# EAGLE design SD Card (EAGLE 5.04)
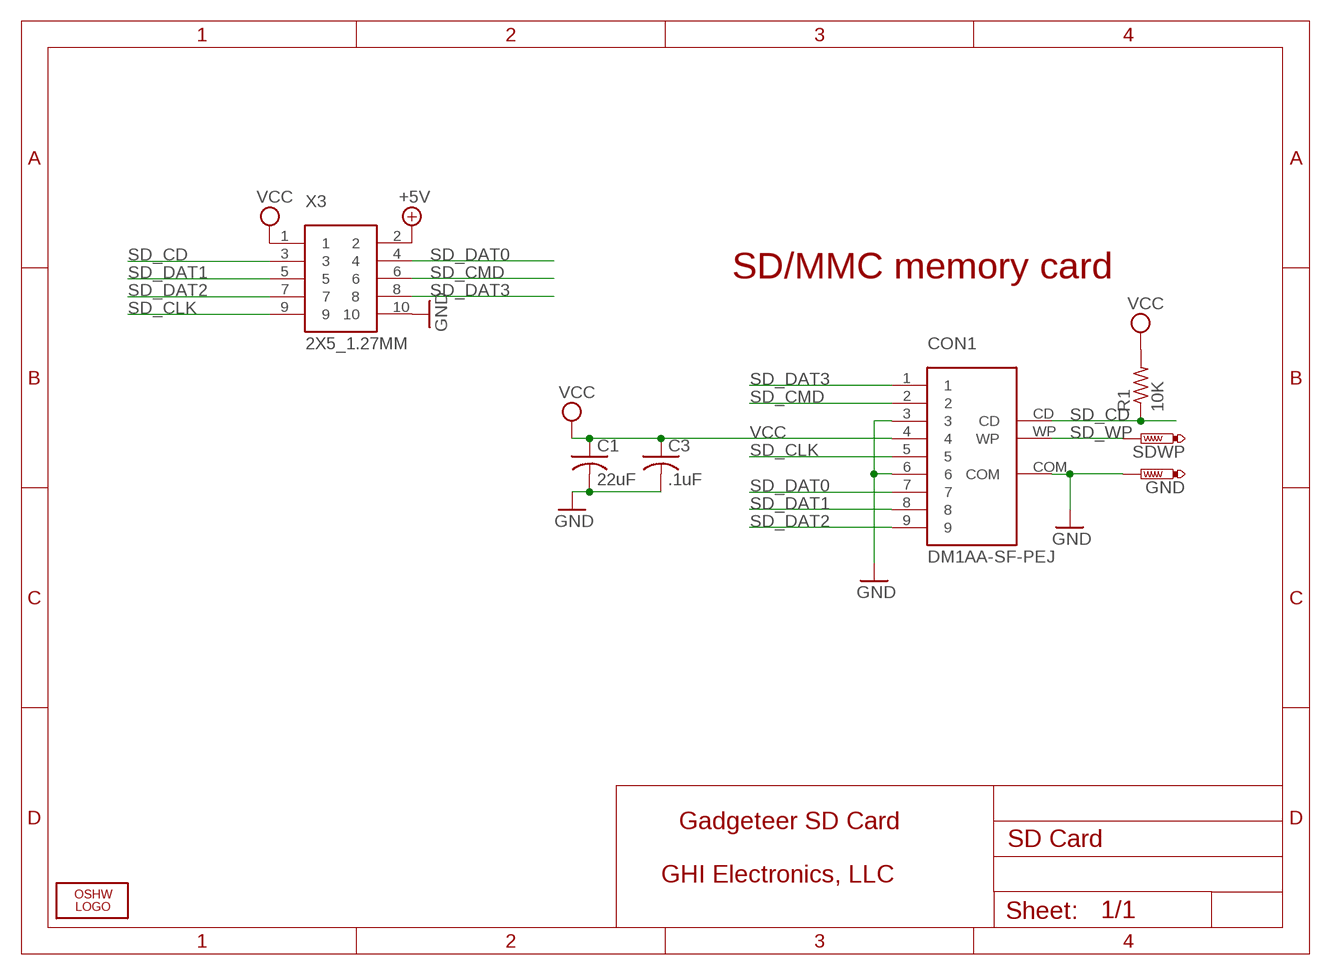
[diagram p0: schematic, sheet 1]

## Parts
C1  22uF  C-USC0805K  [C0805K]
C3  .1uF  C-USC0603K  [C0603K]
CON1  DM1AA-SF-PEJ  [DM1AA-SF-PEJ]
GND  PTR1PAD1-20  [P1-20]
LOGO1  LOGO-OSHW-FILLX0200-NT  [OSHW_FILLX200_NOTEXT]
R1  10K  R-US_R0603  [R0603]
SDWP  PTR1PAD1-20  [P1-20]
X3  2X5_1.27MM  [2X5_1.27MM]

## Nets
+5V [power]: X3.2
GND [power]: C1.2 C3.2 CON1.3 CON1.6 CON1.COM GND.1(TP) X3.10
SD_CD: CON1.CD R1.1 X3.3
SD_CLK: CON1.5 X3.9
SD_CMD: CON1.2 X3.6
SD_DAT0: CON1.7 X3.4
SD_DAT1: CON1.8 X3.5
SD_DAT2: CON1.9 X3.7
SD_DAT3: CON1.1 X3.8
SD_WP: CON1.WP SDWP.1(TP)
VCC [power]: C1.1 C3.1 CON1.4 R1.2 X3.1

## Notes on the sheet
- SD/MMC memory card
- Gadgeteer SD Card
- GHI Electronics, LLC

## Library data of the parts
C1 C3 = rcl:C-US: CAPACITOR, American symbol
CON1 = GHI:DM1AA-SF-PEJ
GND SDWP = testpad:PTR1: TEST PIN
LOGO1 = Logo:LOGO-OSHW-FILL
R1 = rcl:R-US_: RESISTOR, American symbol
X3 = GHI:2X5_1.27MM

## Net classes
0 default: width 0.254 mm, drill 0.381 mm, clearance 0.203 mm

## Board
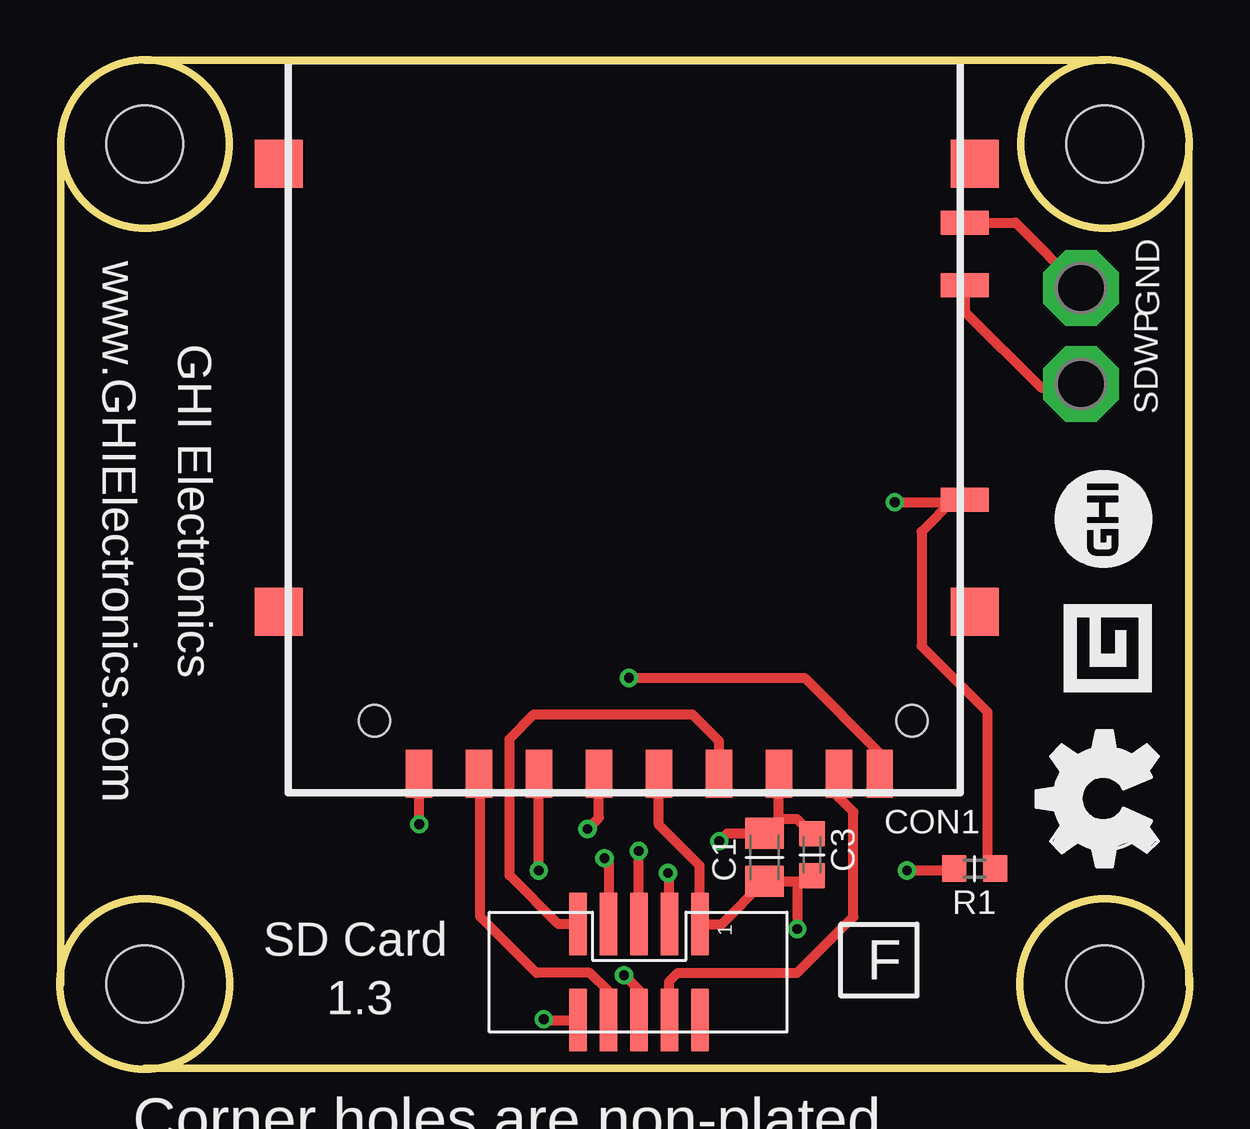
[diagram p1: board, top side]
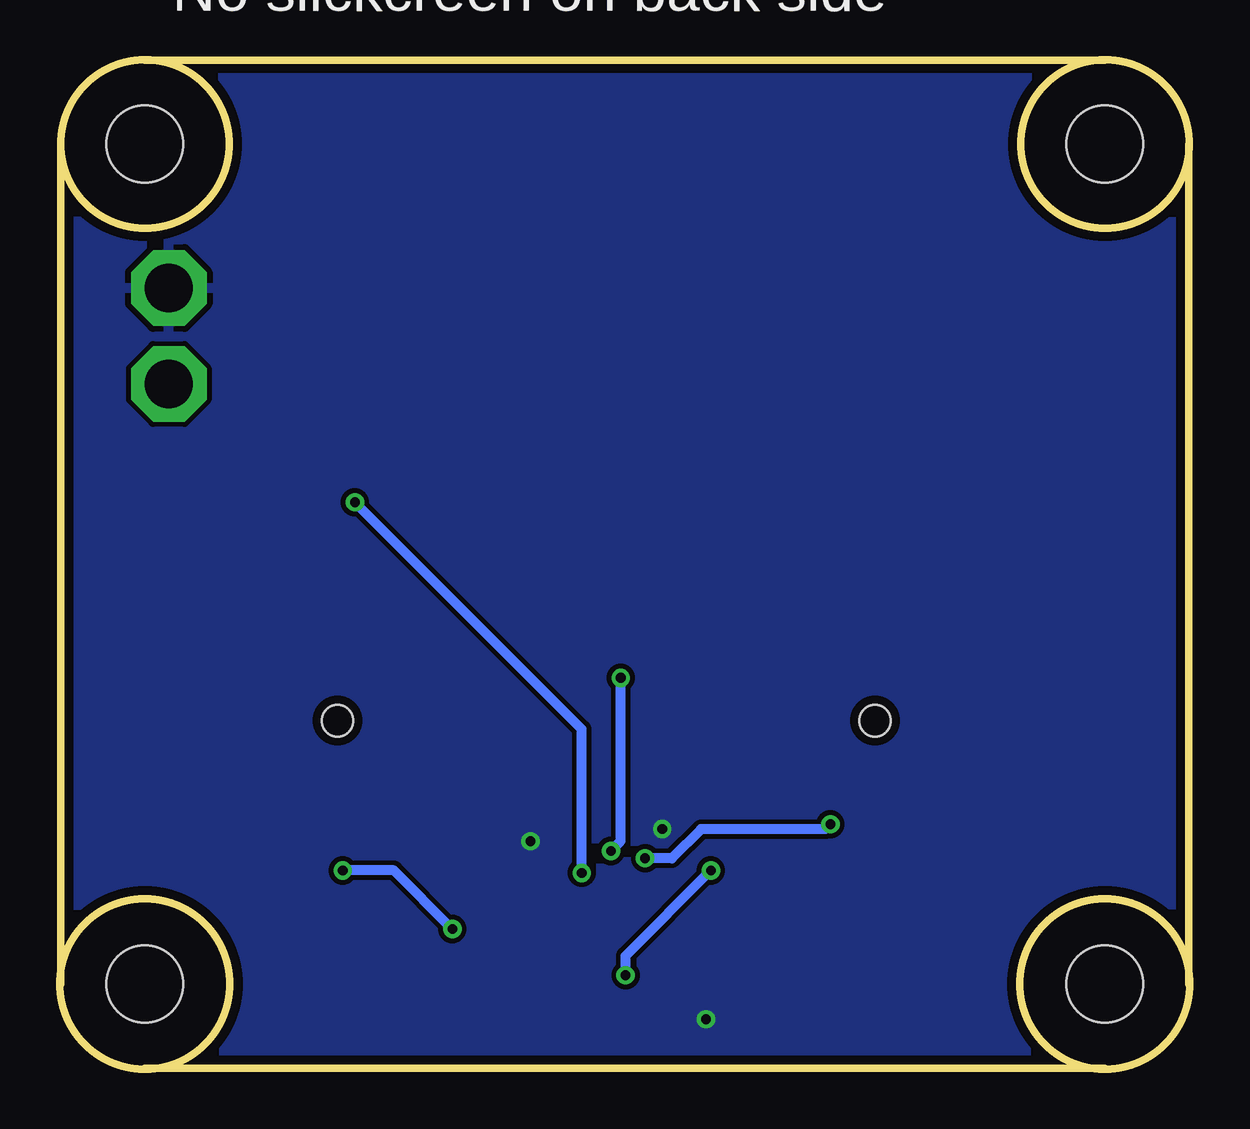
[diagram p2: board, bottom side, seen from below]

Size 47.07 x 42.04 mm. Coordinates in mm from the lower left corner, seen from the top.
Outline: 47.04,3.54 47.04,38.54
Outline: 0.04,38.54 0.04,3.54
Outline: 3.54,42.04 43.54,42.04
Outline: 43.54,0.04 3.54,0.04
Outline: circle at 3.54,38.54 radius 3.5
Outline: circle at 43.54,38.54 radius 3.5
Outline: circle at 43.54,3.54 radius 3.54
Outline: circle at 3.54,3.54 radius 3.54
Copper layers (1+16): Top 0.035mm / dielectric 1.5mm / Bottom 0.035mm
Design rules "default *": minimum track width 8mil, minimum drill 12mil, track to track 8mil, track to pad 8mil, pad to pad 8mil, via to via 8mil, smd to smd 8mil, copper to edge 15mil, drill to drill 8mil, minimum pad ring 10mil, minimum via ring 7mil, stop-mask expansion 4mil, vias tented up to drill 50mil, thermal gap 10mil
Holes 3.2 mm at 3.54,3.54 43.54,38.54 3.54,38.54 43.54,3.54

### Footprints (pad centres in the part's own frame; a part is rotated, then mirrored left to right if it is on the bottom)
C0805K = smd 1.3 x 1.6: 1 -1,0; 2 1,0
C0603K = smd 1.05 x 1.08: 1 -0.875,0; 2 0.875,0
DM1AA-SF-PEJ = smd 1.1 x 2: 1 6.08,15.73; 2 3.58,15.73; 3 1.08,15.73; 4 -1.42,15.73; 5 -3.92,15.73; 6 -6.42,15.73; 7 -8.92,15.73; 8 -10.62,15.73; 9 8.58,15.73 | smd 2 x 1: CD -14.17,4.33; COM -14.17,-7.22; WP -14.17,-4.62 | smd 2 x 2: P$10 -14.57,-9.67; P$11 -14.57,8.98; P$12 14.43,8.98; P$13 14.43,-9.67 | hole 1.3: -11.97,13.53; 10.43,13.53
P1-20 = drill 2.007 pad 3.15 octagon: 1 0,0
R0603 = smd 1 x 1.1: 1 -0.85,0; 2 0.85,0
2X5_1.27MM = smd 2.6 x 0.74: 1 -2,2.58; 2 2,2.58; 3 -2,1.31; 4 2,1.31; 5 -2,0.04; 6 2,0.04; 7 -2,-1.23; 8 2,-1.23; 9 -2,-2.5; 10 2,-2.5

### Placement (x,y rotation side)
C1  29.35,8.82 90 top
C3  31.33,8.92 90 top
CON1  23.54,28.04 180 top
GND  42.54,32.54 0 top
LOGO1  45.76,8.42 90 top
R1  38.11,8.34 180 top
SDWP  42.54,28.54 0 top
X3  24.09,4.03 270 top

### Tracks (layer width: path | path; a pad name or v marks a point on that pad's centre or on a via)
GND  (via drill 0.41)
  Top 0.406: X3.10 20.15,2.03 v20.15,2.07 | CON1.3 22.46,10.47 v21.98,9.99 | v27.47,9.48 27.8,9.82 C1.2 29.96,10.42 | 29.96,10.42 CON1.6 | 29.96,10.42 30.71,10.42 C3.2 | CON1.COM 39.82,35.26 GND.1
  pour Bottom: -0.07,41.89 47.18,41.89 47.18,0.04 -0.07,0.04
SD_CD  (via drill 0.41)
  Top 0.406: X3.3 25.4,8.1 v25.33,8.16 | v34.78,23.61 37.61,23.61 CON1.CD 37.73,23.73 37.24,23.73 35.9,22.39 35.9,17.61 38.64,14.87 38.64,8.66 R1.1
  Bottom 0.406: v25.33,8.16 25.33,14.16 v34.78,23.61
SD_CLK
  Top 0.406: CON1.5 27.46,13.66 26.35,14.77 19.75,14.77 18.73,13.75 18.73,8.06 20.76,6.03 X3.9 | X3.9
SD_CMD  (via drill 0.41)
  Top 0.406: X3.6 24.13,3.28 v23.51,3.9 | v19.95,8.27 CON1.2
  Bottom 0.406: v23.51,3.9 23.51,4.71 v19.95,8.27
SD_DAT0
  Top 0.406: X3.4 25.4,3.65 25.74,4 30.72,4 33.06,6.33 33.06,10.7 32.45,11.31 CON1.7
SD_DAT1  (via drill 0.41)
  Top 0.406: CON1.8 34.16,13.16 31.02,16.29 v23.71,16.29 | v24.11,9.08 24.11,6.04 X3.5
  Bottom 0.406: v23.71,16.29 23.71,9.48 v24.11,9.08
SD_DAT2  (via drill 0.41)
  Top 0.406: X3.7 22.86,8.61 v22.69,8.77 | v14.97,10.2 14.97,12.29 CON1.9
  Bottom 0.406: v22.69,8.77 21.57,8.77 20.36,9.99 15.17,9.99 v14.97,10.2
SD_DAT3
  Top 0.406: X3.8 22.86,3.22 22.08,4 19.85,4 17.51,6.33 17.51,12.25 CON1.1
SD_WP
  Top 0.406: CON1.WP 37.71,31.56 40.88,28.38 42.38,28.38 SDWP.1
VCC  (via drill 0.41)
  Top 0.406: 30.82,7.82 C1.1 27.57,6.03 X3.1 26.65,6.04 26.65,8.47 24.96,10.17 CON1.4 | 30.82,7.82 31.11,7.82 C3.1 31.35,8.06 | v30.72,5.83 30.72,7.71 30.82,7.82 | v35.29,8.27 37.18,8.27 R1.2
  Bottom 0.406: v35.29,8.27 33.16,8.27 v30.72,5.83

### Text on the board
tPlace: www.GHIElectronics.com | GHI Electronics | SD Card | F | 1.3 | Corner holes are non-plated | black PCB with white text | do not add manufacturing codes
bPlace: No silckcreen on back side